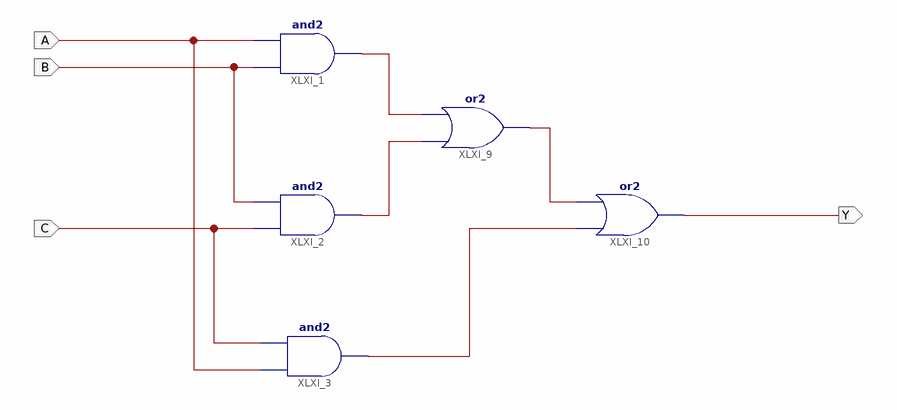
[diagram p0: schematic sheet 1]
// Xilinx ISE schematic MAJORITY.sch (spartan6) as structural Verilog: 5 symbols, 4 ports
module MAJORITY (
  input  A,
  input  B,
  input  C,
  output Y
);

  wire XLXN_5, XLXN_6, XLXN_7, XLXN_8;

  and XLXI_1 (XLXN_8, B, A);
  and XLXI_2 (XLXN_7, C, B);
  and XLXI_3 (XLXN_6, A, C);
  or XLXI_9 (XLXN_5, XLXN_7, XLXN_8);
  or XLXI_10 (Y, XLXN_6, XLXN_5);
endmodule
